# EAGLE design cruise (EAGLE 9.3.1)
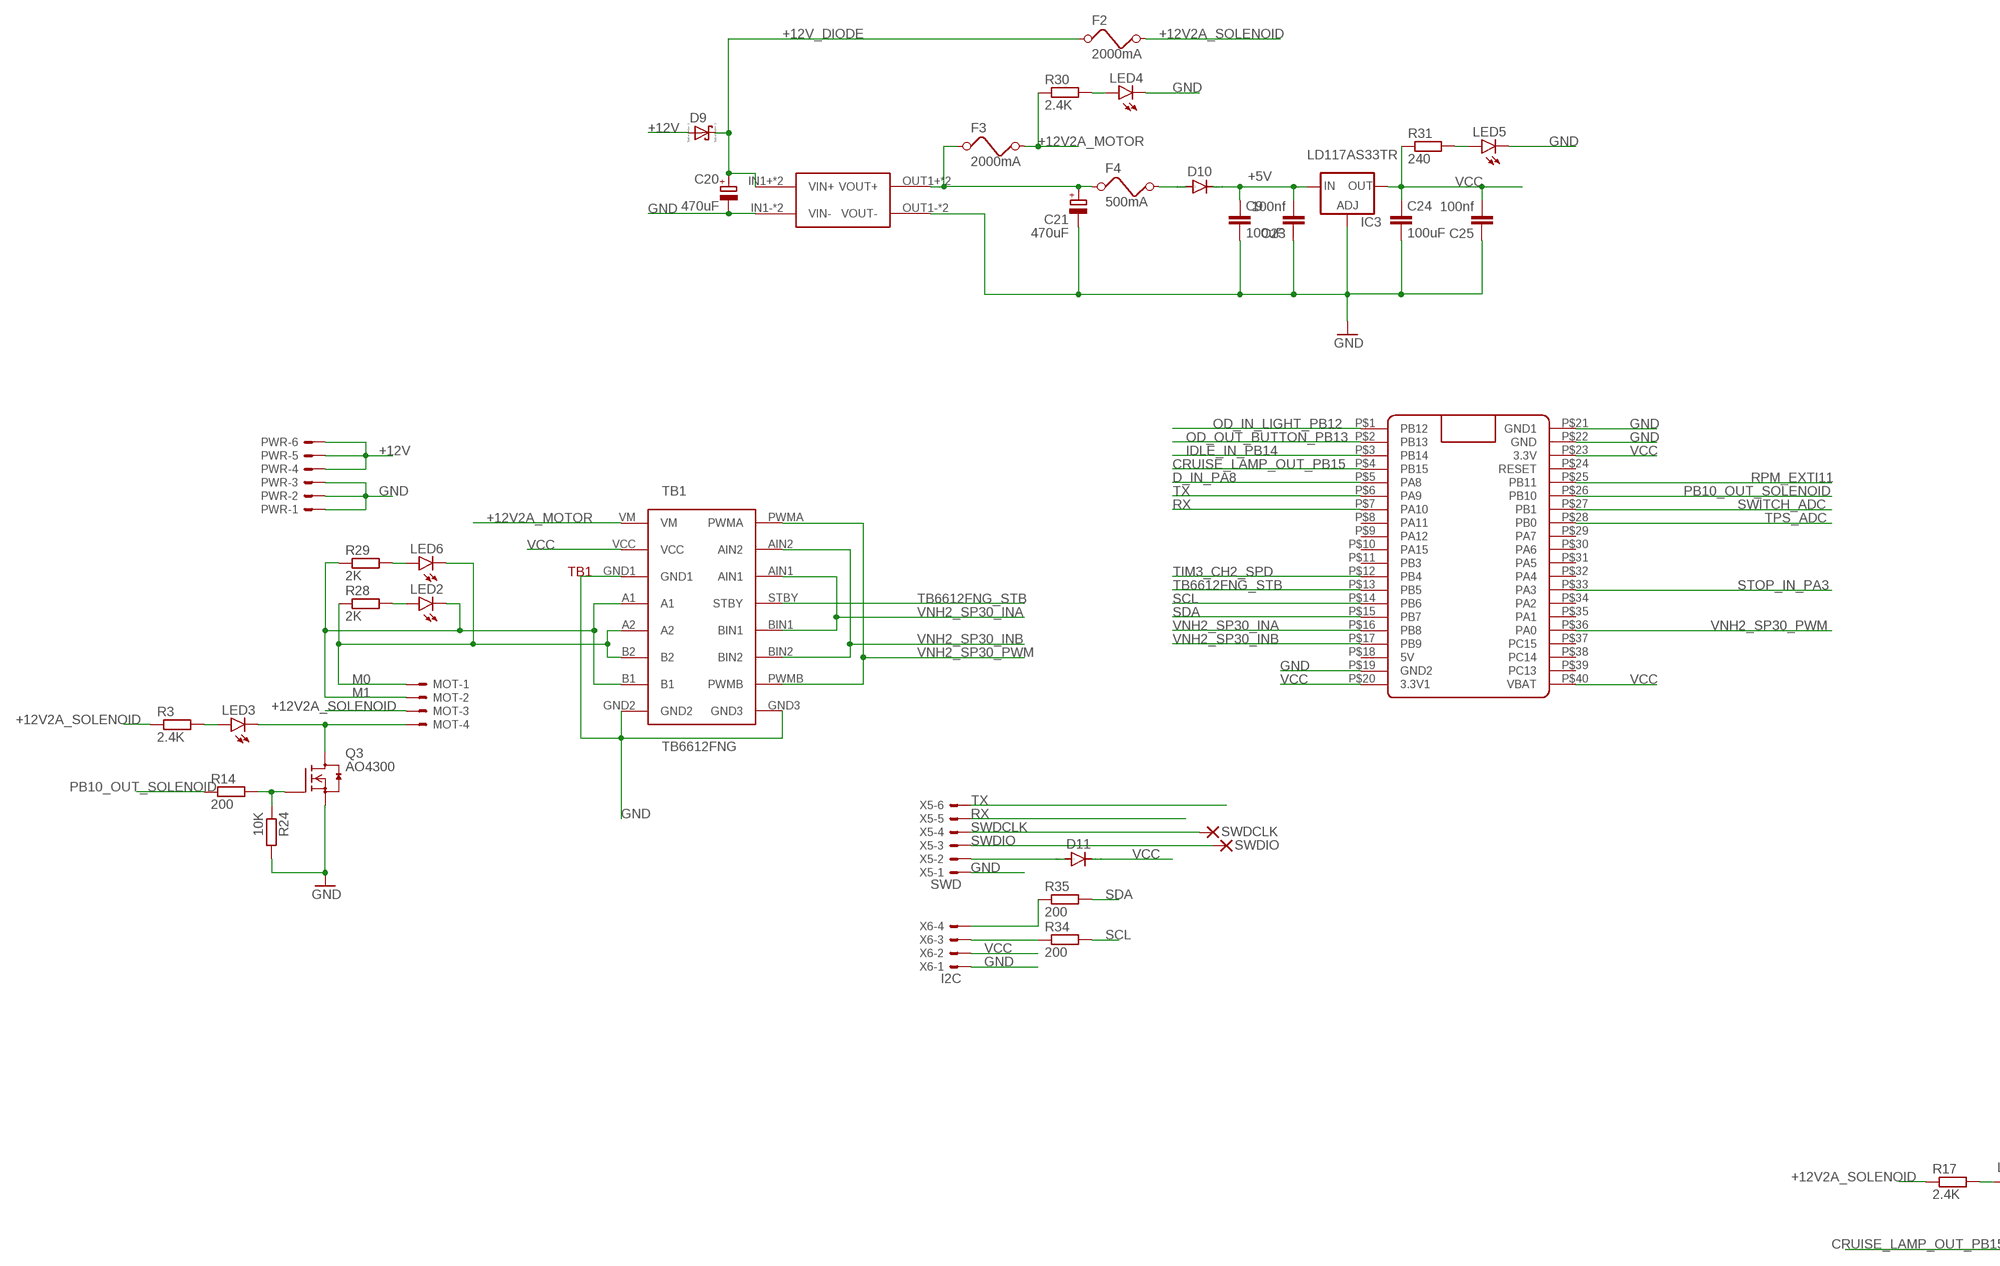
[diagram p0: schematic, sheet 1, part 1 of 2]
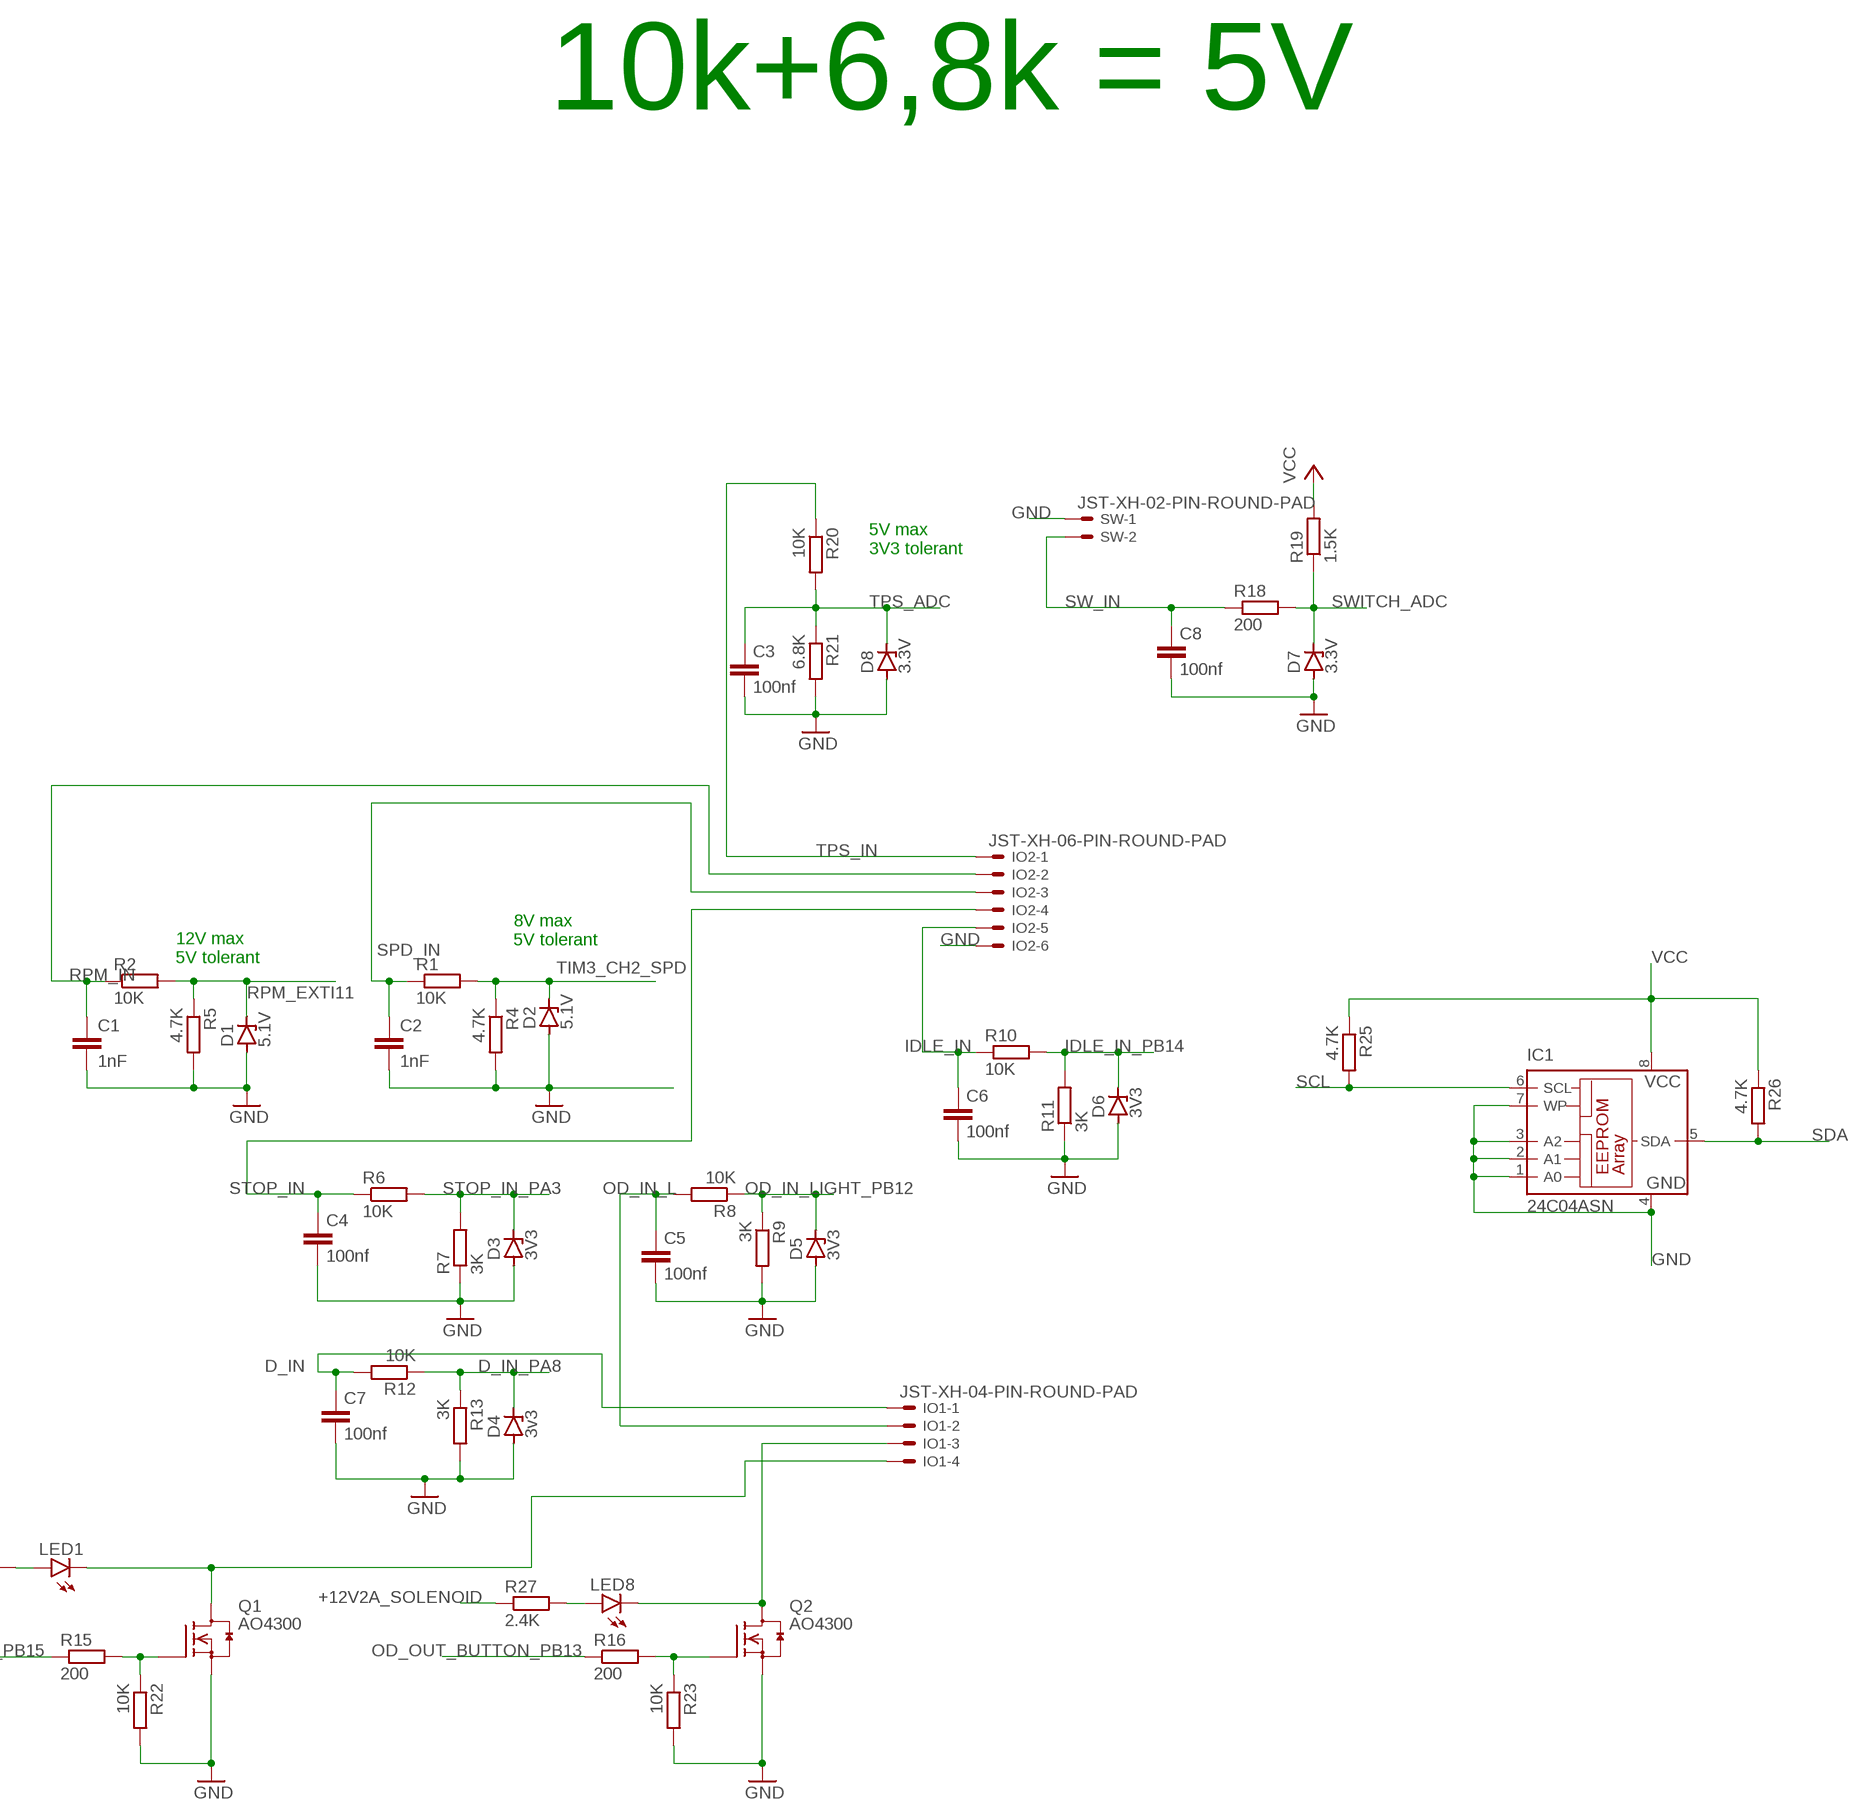
[diagram p1: schematic, sheet 1, part 2 of 2]

## Parts
C1  1nF  C-EUC0805K  [C0805K]
C2  1nF  C-EUC0805K  [C0805K]
C3  100nf  C-EUC0805K  [C0805K]
C4  100nf  C-EUC0805K  [C0805K]
C5  100nf  C-EUC0805K  [C0805K]
C6  100nf  C-EUC0805K  [C0805K]
C7  100nf  C-EUC0805K  [C0805K]
C8  100nf  C-EUC0805K  [C0805K]
C9  100uF  C-EUC1210  [C1210]
C20  470uF  CPOL-EUG  [PANASONIC_G]
C21  470uF  CPOL-EUG  [PANASONIC_G]
C23  100nf  C-EUC0805  [C0805]
C24  100uF  C-EUC1210  [C1210]
C25  100nf  C-EUC0805  [C0805]
D1  5.1V  ZENER-DIODESOD80C  [SOD80C]
D2  5.1V  ZENER-DIODESOD80C  [SOD80C]
D3  3V3  ZENER-DIODESOD80C  [SOD80C]
D4  3v3  ZENER-DIODESOD80C  [SOD80C]
D5  3V3  ZENER-DIODESOD80C  [SOD80C]
D6  3V3  ZENER-DIODESOD80C  [SOD80C]
D7  3.3V  ZENER-DIODESOD80C  [SOD80C]
D8  3.3V  ZENER-DIODESOD80C  [SOD80C]
D9  SCHOTTKY-DIODESMC  [DIODE_SMC]
D10  DIODE-SOD323-W  [SOD323-W]
D11  DIODE-SOD323-W  [SOD323-W]
F2  2000mA  FUSEC  [1206]
F3  2000mA  FUSEC  [1206]
F4  500mA  FUSEC  [1206]
IC1  24C04ASN  [SO-08]
IC3  LD117AS33TR  [SOT223]
IO1  JST-XH-04-PIN-ROUND-PAD  [JST-XH-04-PACKAGE-ROUND-PAD]
IO2  JST-XH-06-PIN-ROUND-PAD  [JST-XH-06-PACKAGE-ROUND-PAD]
LED1  LED3MM  [LED3MM]
LED2  LED3MM  [LED3MM]
LED3  LED3MM  [LED3MM]
LED4  LED3MM  [LED3MM]
LED5  LED3MM  [LED3MM]
LED6  LED3MM  [LED3MM]
LED8  LED3MM  [LED3MM]
MOT  JST-XH-04-PIN-LONG-PAD  [JST-XH-04-PACKAGE-LONG-PAD]
PWR  JST-XH-06-PIN-LONG-PAD  [JST-XH-06-PACKAGE-LONG-PAD]
Q1  AO4300  BSS138  [SOT23]
Q2  AO4300  BSS138  [SOT23]
Q3  AO4300  BSS138  [SOT23]
R1  10K  R-EU_R0805  [R0805]
R2  10K  R-EU_R0805  [R0805]
R3  2.4K  R-EU_R0805  [R0805]
R4  4.7K  R-EU_R0805  [R0805]
R5  4.7K  R-EU_R0805  [R0805]
R6  10K  R-EU_R0805  [R0805]
R7  3K  R-EU_R0805  [R0805]
R8  10K  R-EU_R0805  [R0805]
R9  3K  R-EU_R0805  [R0805]
R10  10K  R-EU_R0805  [R0805]
R11  3K  R-EU_R0805  [R0805]
R12  10K  R-EU_R0805  [R0805]
R13  3K  R-EU_R0805  [R0805]
R14  200  R-EU_R0805  [R0805]
R15  200  R-EU_R0805  [R0805]
R16  200  R-EU_R0805  [R0805]
R17  2.4K  R-EU_R0805  [R0805]
R18  200  R-EU_R0805  [R0805]
R19  1.5K  R-EU_R0805  [R0805]
R20  10K  R-EU_R0805  [R0805]
R21  6.8K  R-EU_R0805  [R0805]
R22  10K  R-EU_R0805  [R0805]
R23  10K  R-EU_R0805  [R0805]
R24  10K  R-EU_R0805  [R0805]
R25  4.7K  R-EU_R0805  [R0805]
R26  4.7K  R-EU_R0805  [R0805]
R27  2.4K  R-EU_R0805  [R0805]
R28  2K  R-EU_R0805  [R0805]
R29  2K  R-EU_R0805  [R0805]
R30  2.4K  R-EU_R0805  [R0805]
R31  240  R-EU_R0805  [R0805]
R34  200  R-EU_R0805  [R0805]
R35  200  R-EU_R0805  [R0805]
SW  JST-XH-02-PIN-ROUND-PAD  [JST-XH-02-PACKAGE-ROUND-PAD]
SWDCLK  WIREPAD2,15/1,0  [2,15/1,0]
SWDIO  WIREPAD2,15/1,0  [2,15/1,0]
TB1  TB6612FNG  [TB6612FNG]
U$1  BLUE_PILL  [BLUE_PILL]
U$6  MP1584  [DC-BRICK]
X5  SWD  JST-XH-06-PIN-ROUND-PAD  [JST-XH-06-PACKAGE-ROUND-PAD]
X6  I2C  JST-XH-04-PIN-ROUND-PAD  [JST-XH-04-PACKAGE-ROUND-PAD]

## Nets
+5V: C9.1 C23.2 D10.C IC3.3(IN)
+12V: D9.A(C) PWR.4 PWR.5 PWR.6
+12V2A_MOTOR: F3.2 R30.1 TB1.VM
+12V2A_SOLENOID: F2.2 MOT.3 R3.1 R17.1 R27.1
+12V_DIODE: C20.+ D9.C(A) F2.1 U$6.IN1+(VIN+) U$6.IN2+(VIN+)
CRUISE_LAMP_OUT_PB15: R15.1 U$1.P$4(PB15)
D_IN: C7.1 IO1.1 R12.2
D_IN_PA8: D4.C R12.1 R13.1 U$1.P$5(PA8)
GND: C1.2 C2.2 C3.2 C4.2 C5.2 C6.2 C7.2 C8.2 C9.2 C20.- C21.- C23.1 C24.2 C25.1 D1.A D2.A D3.A D4.A D5.A D6.A D7.A D8.A IC1.1(A0) IC1.2(A1) IC1.3(A2) IC1.4(GND) IC1.7(WP) IC3.1(ADJ) IO2.6 LED4.K(C) LED5.K(C) PWR.1 PWR.2 PWR.3 Q1.2(S) Q2.2(S) Q3.2(S) R4.2 R5.2 R7.1 R9.2 R11.1 R13.2 R21.2 R22.2 R23.2 R24.2 SW.1 TB1.GND1 TB1.GND2 TB1.GND3 U$1.P$19(GND2) U$1.P$21(GND1) U$1.P$22(GND) U$6.IN1-(VIN-) U$6.IN2-(VIN-) U$6.OUT1-(VOUT-) U$6.OUT2-(VOUT-) X5.1 X6.1
IDLE_IN: C6.1 IO2.5 R10.1
IDLE_IN_PB14: D6.C R10.2 R11.2 U$1.P$3(PB14)
M0: LED6.K(C) MOT.1 R28.1 TB1.A2 TB1.B2
M1: LED2.K(C) MOT.2 R29.1 TB1.A1 TB1.B1
N$1: LED1.A R17.2
N$2: D10.A F4.2
N$3: D11.A X5.2
N$4: LED3.A R3.2
N$5: C21.+ F3.1 F4.1 U$6.OUT1+(VOUT+) U$6.OUT2+(VOUT+)
N$6: LED3.K(C) MOT.4 Q3.3(D)
N$7: LED2.A R28.2
N$8: Q3.1(G) R14.2 R24.1
N$9: LED8.A R27.2
N$10: Q1.1(G) R15.2 R22.1
N$11: R34.1 X6.3
N$12: R35.1 X6.4
N$13: LED6.A R29.2
N$14: Q2.1(G) R16.2 R23.1
N$15: LED4.A R30.2
N$16: LED5.A R31.2
N$32: IO1.4 LED1.K(C) Q1.3(D)
N$35: IO1.3 LED8.K(C) Q2.3(D)
OD_IN_L: C5.1 IO1.2 R8.2
OD_IN_LIGHT_PB12: D5.C R8.1 R9.1 U$1.P$1(PB12)
OD_OUT_BUTTON_PB13: R16.1 U$1.P$2(PB13)
PB10_OUT_SOLENOID: R14.1 U$1.P$26(PB10)
RPM_EXTI11: D1.C R2.2 R5.1 U$1.P$25(PB11)
RPM_IN: C1.1 IO2.2 R2.1
RX: U$1.P$7(PA10) X5.5
SCL: IC1.6(SCL) R25.2 R34.2 U$1.P$14(PB6)
SDA: IC1.5(SDA) R26.2 R35.2 U$1.P$15(PB7)
SPD_IN: C2.1 IO2.3 R1.1
STOP_IN: C4.1 IO2.4 R6.1
STOP_IN_PA3: D3.C R6.2 R7.2 U$1.P$33(PA3)
SW_IN: C8.1 R18.1 SW.2
SWDCLK: SWDCLK.1(P) X5.4
SWDIO: SWDIO.1(P) X5.3
SWITCH_ADC: D7.C R18.2 R19.1 U$1.P$27(PB1)
TB6612FNG_STB: TB1.STBY U$1.P$13(PB5)
TIM3_CH2_SPD: D2.C R1.2 R4.1 U$1.P$12(PB4)
TPS_ADC: C3.1 D8.C R20.2 R21.1 U$1.P$28(PB0)
TPS_IN: IO2.1 R20.1
TX: U$1.P$6(PA9) X5.6
VCC: C24.1 C25.2 D11.C IC1.8(VCC) IC3.4(OUT) R19.2 R25.1 R26.1 R31.1 TB1.VCC U$1.P$20(3.3V1) U$1.P$23(3.3V) U$1.P$40(VBAT) X6.2
VNH2_SP30_INA: TB1.AIN1 TB1.BIN1 U$1.P$16(PB8)
VNH2_SP30_INB: TB1.AIN2 TB1.BIN2 U$1.P$17(PB9)
VNH2_SP30_PWM: TB1.PWMA TB1.PWMB U$1.P$36(PA0)
Unconnected: U$1.P$8(PA11) U$1.P$9(PA12) U$1.P$10(PA15) U$1.P$11(PB3) U$1.P$18(5V) U$1.P$24(RESET) U$1.P$29(PA7) U$1.P$30(PA6) U$1.P$31(PA5) U$1.P$32(PA4) U$1.P$34(PA2) U$1.P$35(PA1) U$1.P$37(PC15) U$1.P$38(PC14) U$1.P$39(PC13)

## Notes on the sheet
- 10k+6,8k = 5V
- 5V max
  3V3 tolerant
- 8V max
  5V tolerant
- 12V max
  5V tolerant

## Library data of the parts
C1-C8 C23 C25 = rcl:C-EU: CAPACITOR, European symbol; SPICEPREFIX: C
C9 C24 = resistor:C-EU: CAPACITOR, European symbol
C20 C21 = rcl:CPOL-EU: POLARIZED CAPACITOR, European symbol; SPICEPREFIX: C
D1-D8 = diode:ZENER-DIODE: Z-Diode
D9 = eagle-ltspice:SCHOTTKY-DIODE: Schottky Diode; SPICEMODEL: NONE; SPICEPREFIX: D; SPICETYPE: diode
D10 D11 = diode:DIODE-: DIODE
F2-F4 = m-pad-2.1:FUSE: Fuse's in various packages
IC1 = microchip:24C*: Serial EEPROM 1 K/2 K/4 K; OC_FARNELL: unknown; OC_NEWARK: unknown
IC3 = v-reg:LD117A?*: Low drop fixed and adjustable positive voltage regulators 1 A Source: http://www.st.com/stonline/products/literature/ds/7194/ld1117axx.pdf
IO1 MOT X6 = Rembrandt Electronics - JST XH Connectors v1-0:JST-XH-04-PIN: JST XH Connector 2 Pin Wire to board connector. Pitch: 2,54 mm, (0.100") Number of pins: 4 Created by Rembrandt Electronics www.rembrandtelectronics.com
IO2 PWR X5 = Rembrandt Electronics - JST XH Connectors v1-0:JST-XH-06-PIN: JST XH Connector 2 Pin Wire to board connector. Pitch: 2,54 mm, (0.100") Number of pins: 6 Created by Rembrandt Electronics www.rembrandtelectronics.com
LED1-LED6 LED8 = led:LED: LED OSRAM: - CHIPLED LG R971, LG N971, LY N971, LG Q971, LY Q971, LO R971, LY R971 LH N974, LH R974 LS Q976, LO Q976, LY Q976 LO Q996 - Hyper CHIPLED LW Q18S LB Q993, LB Q99A, LB R99A - SideLED LS A670, LO A670, LY A670, LG A670, LP A670 LB A673, LV A673, LT A673, LW A673 LH A674 LY A675 LS A676, LA A676, LO A676, LY A676, LW A676 LS A679, LY A679, LG A679 - Hyper Micro SIDELED® LS Y876, LA Y876, LO Y876, LY Y876 LT Y87S - SmartLED LW L88C, LW L88S LB L89C, LB L89S, LG L890 LS L89K, LO L89K, LY L89K LS L896, LA L896, LO L896, LY L896 - TOPLED LS T670, LO T670, LY T670, LG T670, LP T670 LSG T670, LSP T670, LSY T670, LOP T670, LYG T670 LG T671, LOG T671, LSG T671 LB T673, LV T673, LT T673, LW T673 LH T674 LS T676, LA T676, LO T676, LY T676, LB T676, LH T676, LSB T676, LW T676 LB T67C, LV T67C, LT T67C, LS T67K, LO T67K, LY T67K, LW E67C LS E67B, LA E67B, LO E67B, LY E67B, LB E67C, LV E67C, LT E67C LW T67C LS T679, LY T679, LG T679 LS T770, LO T770, LY T770, LG T770, LP T770 LB T773, LV T773, LT T773, LW T773 LH T774 LS E675, LA E675, LY E675, LS T675 LS T776, LA T776, LO T776, LY T776, LB T776 LHGB T686 LT T68C, LB T68C - Hyper Mini TOPLED® LB M676 - Mini TOPLED Santana® LG M470 LS M47K, LO M47K, LY M47K Source: http://www.osram.convergy.de LUXEON: - LUMILED® LXK2-PW12-R00, LXK2-PW12-S00, LXK2-PW14-U00, LXK2-PW14-V00 LXK2-PM12-R00, LXK2-PM12-S00, LXK2-PM14-U00 LXK2-PE12-Q00, LXK2-PE12-R00, LXK2-PE12-S00, LXK2-PE14-T00, LXK2-PE14-U00 LXK2-PB12-K00, LXK2-PB12-L00, LXK2-PB12-M00, LXK2-PB14-N00, LXK2-PB14-P00, LXK2-PB14-Q00 LXK2-PR12-L00, LXK2-PR12-M00, LXK2-PR14-Q00, LXK2-PR14-R00 LXK2-PD12-Q00, LXK2-PD12-R00, LXK2-PD12-S00 LXK2-PH12-R00, LXK2-PH12-S00 LXK2-PL12-P00, LXK2-PL12-Q00, LXK2-PL12-R00 Source: www.luxeon.com KINGBRIGHT: KA-3528ASYC Source: www.kingbright.com
Q1-Q3 = m-pad-2.1:BSS138: Fairchild Semiconductors BSS138 N-Channel Logic Level Enhancement Mode Field Effect Transistor General Description: These N-Channel enhancement mode field effect transistors are produced using Fairchild's proprietary, high cell density, DMOS technology. These products have been designed to minimize on-state resistance while provide rugged, reliable, and fast switching performance.These products are particularly suited for low voltage, low current applications such as small servo motor control, power MOSFET gate drivers, and other switching applications. Features: 0.22 A, 50 V. RDS(ON) = 3.5Ohm @ VGS = 10 V RDS(ON) = 6.0Ohm @ VGS = 4.5 V High density cell design for extremely low RDS(ON) Rugged and Reliable Compact industry standard SOT-23 surface mount package Please send any comments to: messi@users.sourceforge.net
R1-R31 R34 R35 = resistor:R-EU_: RESISTOR, European symbol
SW = Rembrandt Electronics - JST XH Connectors v1-0:JST-XH-02-PIN: JST XH Connector 2 Pin Wire to board connector. Pitch: 2,54 mm, (0.100") Number of pins: 2 Created by Rembrandt Electronics www.rembrandtelectronics.com
SWDCLK SWDIO = wirepad:WIREPAD: Wire PAD connect wire on PCB
TB1 = TB6612FNG:TB6612FNG
U$1 = BluePill:BLUE_PILL
U$6 = MP1584-dc-brick:MP1584: MP1584-dc-brick-pcb Step down Input: 4.5V - 28V Ouput 0.8V - 25V max. 3A Cheap on ebay

## Board
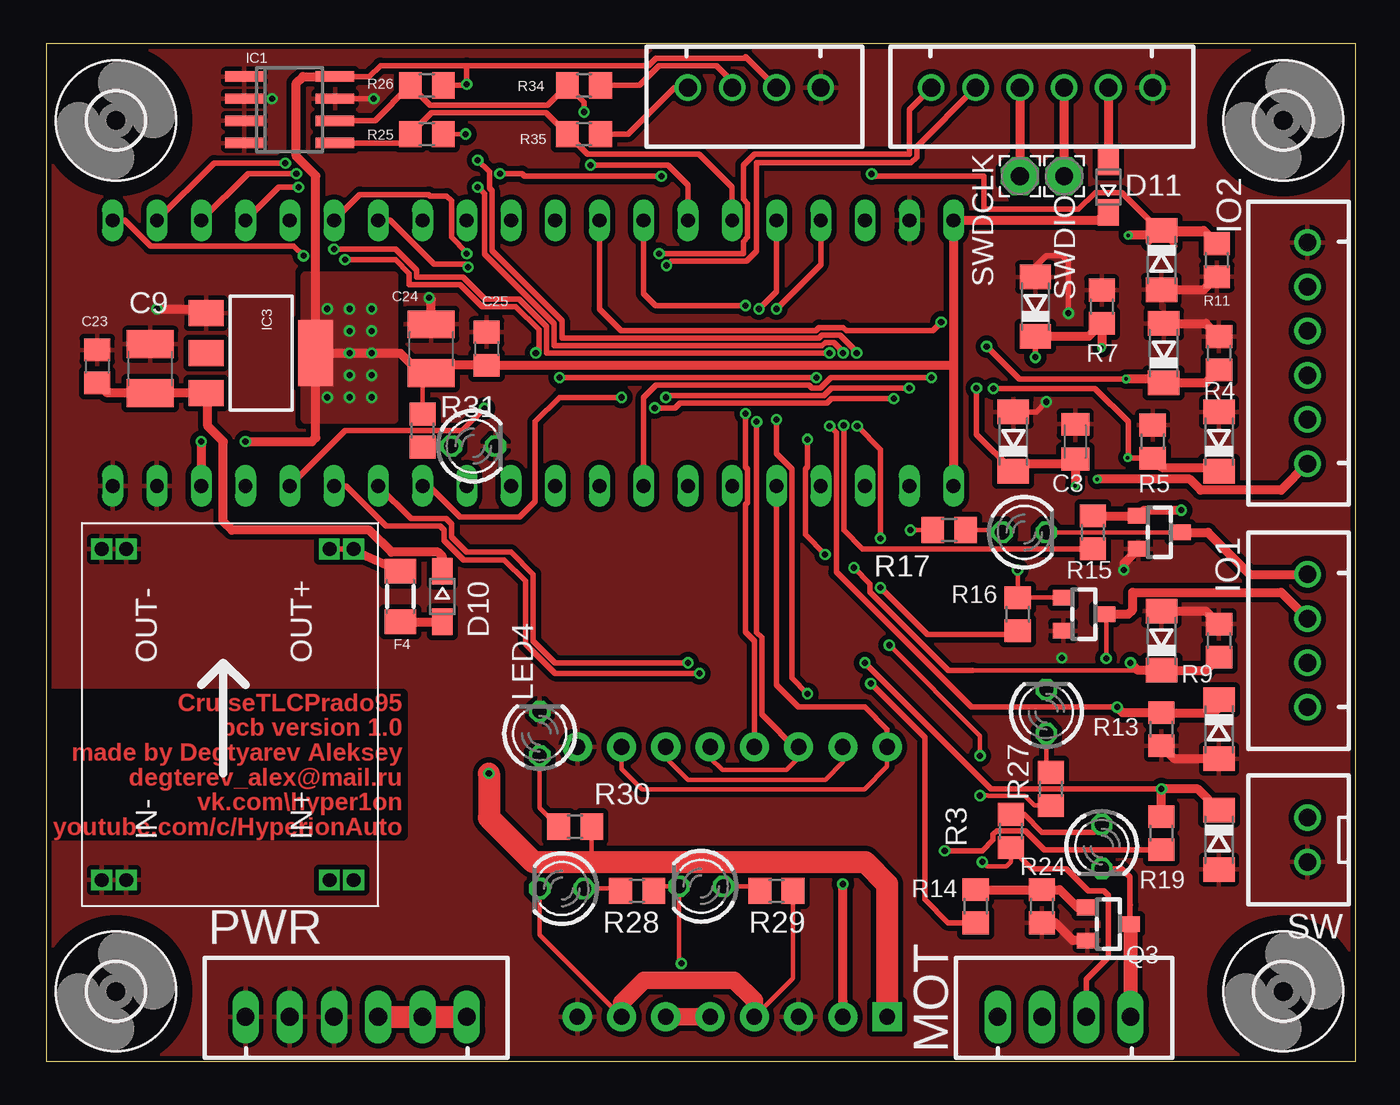
[diagram p2: board, top side]
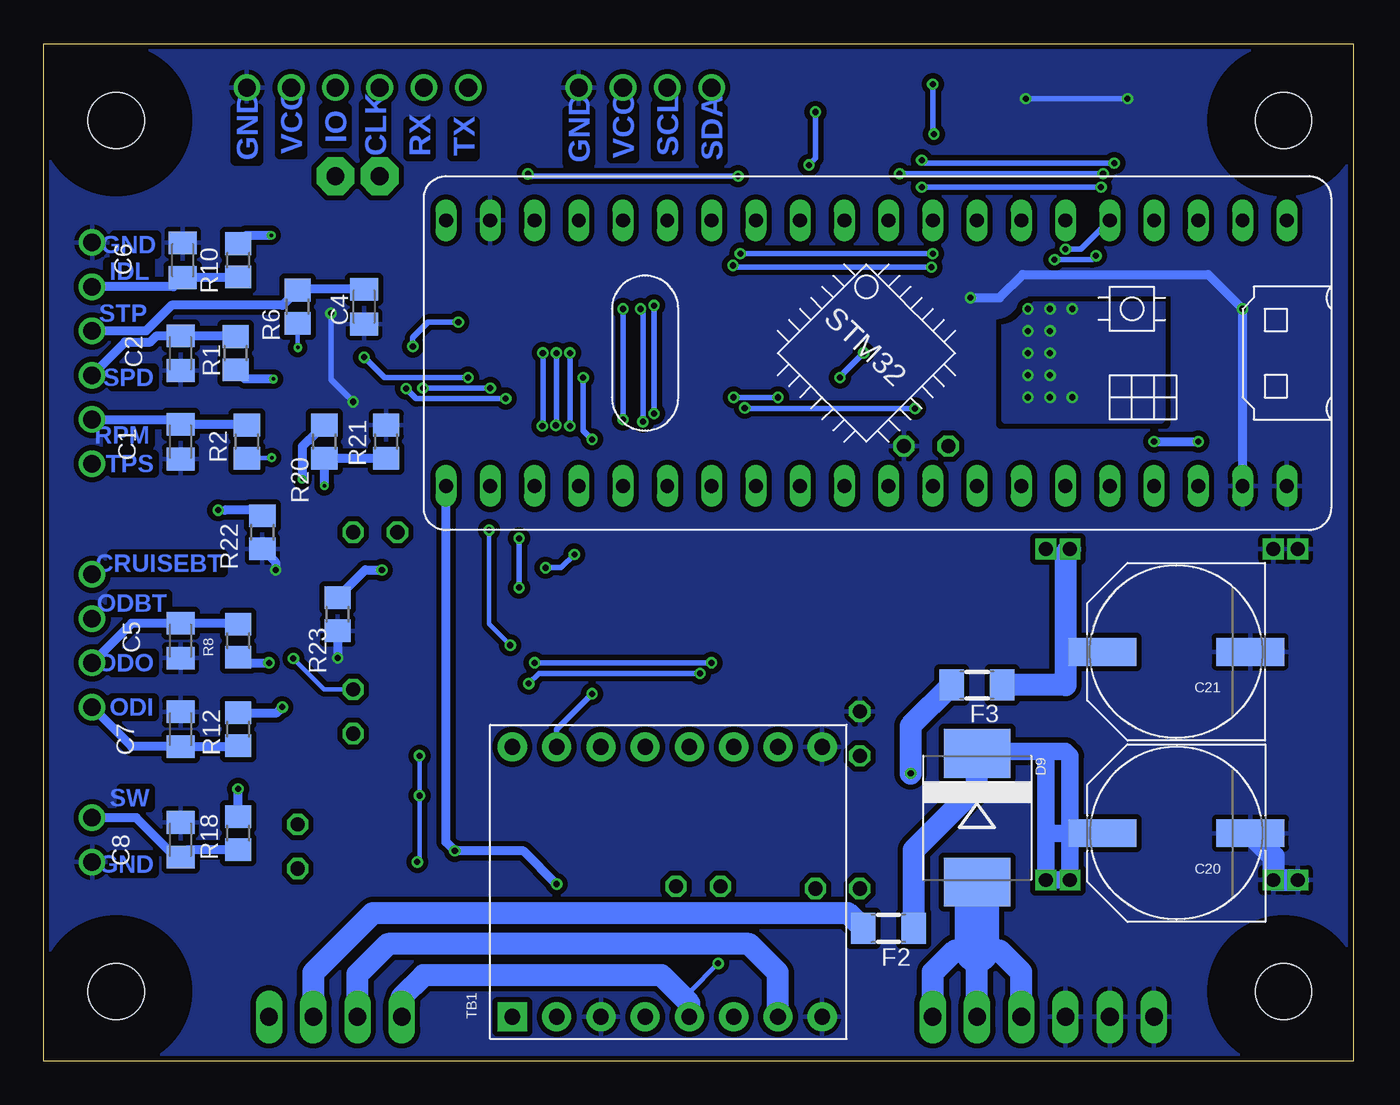
[diagram p3: board, bottom side, seen from below]

Size 75.17 x 58.41 mm. Coordinates in mm from the lower left corner, seen from the top.
Outline: 0,0 75.17,0 75.17,58.41 0,58.41 0,0
Copper layers (1*16): Top 0.035mm / dielectric 1.5mm / Bottom 0.035mm
Design rules "jlcpcb": minimum track width 5mil, minimum drill 0.2mm, track to track 5mil, track to pad 5mil, pad to pad 5mil, via to via 5mil, smd to smd 5mil, copper to edge 0.2mm, drill to drill 6mil, minimum pad ring 0.2mm, minimum via ring 0.15mm, stop-mask expansion 4mil, vias tented up to drill 0mil, thermal gap 10mil

### Footprints (pad centres in the part's own frame; a part is rotated, then mirrored left to right if it is on the bottom)
C0805K = smd 1.3 x 1.6: 1 -1,0; 2 1,0
C1210 = smd 1.6 x 2.7: 1 -1.4,0; 2 1.4,0
PANASONIC_G = smd 3.9 x 1.6: + 4.25,0; - -4.25,0
C0805 = smd 1.3 x 1.5: 1 -0.95,0; 2 0.95,0
SOD80C = smd 1.4 x 1.8: A 1.7,0; C -1.7,0
DIODE_SMC = smd 2.8 x 3.8: A 3.7,0; C -3.7,0
SOD323-W = smd 1.5 x 1.2: A 1.45,0; C -1.45,0
1206 = smd 1.4 x 1.8: 1 -1.45,0; 2 1.45,0
SO-08 = smd 0.6 x 2.2: 1 -1.905,-2.6; 2 -0.635,-2.6; 3 0.635,-2.6; 4 1.905,-2.6; 5 1.905,2.6; 6 0.635,2.6; 7 -0.635,2.6; 8 -1.905,2.6
SOT223 = smd 1.5 x 2: 1 -2.3,-3.15; 2 0,-3.15; 3 2.3,-3.15 | smd 3.8 x 2: 4 0,3.15
JST-XH-04-PACKAGE-ROUND-PAD = drill 1.016: 1 -3.81,0; 2 -1.27,0; 3 1.27,0; 4 3.81,0
JST-XH-06-PACKAGE-ROUND-PAD = drill 1.016: 1 -6.35,0; 2 -3.81,0; 3 -1.27,0; 4 1.27,0; 5 3.81,0; 6 6.35,0
LED3MM = drill 0.813 octagon: A -1.27,0; K 1.27,0
JST-XH-04-PACKAGE-LONG-PAD = drill 1.016 long: 1 -3.81,0; 2 -1.27,0; 3 1.27,0; 4 3.81,0
JST-XH-06-PACKAGE-LONG-PAD = drill 1.016 long: 1 -6.35,0; 2 -3.81,0; 3 -1.27,0; 4 1.27,0; 5 3.81,0; 6 6.35,0
SOT23 = smd 0.9 x 1.2: 1 -0.95,-1.2; 2 0.95,-1.2; 3 0,1.2
R0805 = smd 1.3 x 1.5: 1 -0.95,0; 2 0.95,0
JST-XH-02-PACKAGE-ROUND-PAD = drill 1.016: 1 -1.27,0; 2 1.27,0
2,15/1,0 = drill 1.016 pad 2.159 octagon: 1 0,0
TB6612FNG = drill 0.9 pad 1.676: A1 -7.62,-1.27; A2 -7.62,-3.81; AIN1 7.874,1.27; AIN2 7.874,3.81; B1 -7.62,-8.89; B2 -7.62,-6.35; BIN1 7.874,-3.81; BIN2 7.874,-6.35; GND1 -7.62,1.27; GND2 -7.62,-11.43; GND3 7.874,-11.43; PWMA 7.874,6.35; PWMB 7.874,-8.89; STBY 7.874,-1.27; VCC -7.62,3.81 | drill 0.9 pad 1.676 square: VM -7.62,6.35
BLUE_PILL = drill 0.8 long: P$1 -7.62,15.24; P$2 -7.62,12.7; P$3 -7.62,10.16; P$4 -7.62,7.62; P$5 -7.62,5.08; P$6 -7.62,2.54; P$7 -7.62,0; P$8 -7.62,-2.54; P$9 -7.62,-5.08; P$10 -7.62,-7.62; P$11 -7.62,-10.16; P$12 -7.62,-12.7; P$13 -7.62,-15.24; P$14 -7.62,-17.78; P$15 -7.62,-20.32; P$16 -7.62,-22.86; P$17 -7.62,-25.4; P$18 -7.62,-27.94; P$19 -7.62,-30.48; P$20 -7.62,-33.02; P$21 7.62,15.24; P$22 7.62,12.7; P$23 7.62,10.16; P$24 7.62,7.62; P$25 7.62,5.08; P$26 7.62,2.54; P$27 7.62,0; P$28 7.62,-2.54; P$29 7.62,-5.08; P$30 7.62,-7.62; P$31 7.62,-10.16; P$32 7.62,-12.7; P$33 7.62,-15.24; P$34 7.62,-17.78; P$35 7.62,-20.32; P$36 7.62,-22.86; P$37 7.62,-25.4; P$38 7.62,-27.94; P$39 7.62,-30.48; P$40 7.62,-33.02
3,2 = hole 3.2: 0,0
DC-BRICK = drill 0.8 square: IN1+ 1.5,1.4; IN1- 1.5,14.47; IN2+ 1.5,2.8; IN2- 1.5,15.87; OUT1+ 20.5,1.4; OUT1- 20.5,14.47; OUT2+ 20.5,2.8; OUT2- 20.5,15.87

### Placement (x,y rotation side)
C1  67.31,35.56 270 bottom
C2  67.31,40.64 270 bottom
C3  59.05,35.56 90 top
C4  56.77,43.31 270 bottom
C5  67.31,24.13 270 bottom
C6  67.18,45.97 90 bottom
C7  67.31,19.05 90 bottom
C8  67.31,12.7 90 bottom
C9  5.97,39.75 90 top
C20  10.15,13.08 180 bottom
C21  10.16,23.5 180 bottom
C23  2.92,39.88 270 top
C24  22.1,40.89 90 top
C25  25.27,40.89 270 top
D1  67.31,35.56 90 top
D2  64.14,40.64 90 top
D3  56.77,43.31 90 top
D4  67.31,19.05 270 top
D5  64.01,24.13 90 top
D6  64.01,45.97 270 top
D7  67.31,12.7 270 top
D8  55.5,35.56 90 top
D9  21.59,13.97 270 bottom
D10  22.73,26.67 270 top
D11  60.96,50.16 90 top
F2  26.67,7.62 180 bottom
F3  21.59,21.59 180 bottom
F4  20.32,26.67 270 top
IC1  13.97,54.61 270 top
IC3  12.32,40.64 270 top
IO1  72.39,24.13 90 top
IO2  72.39,40.64 90 top
LED1  56.13,30.35 0 top
LED2  29.59,9.91 180 top
LED3  60.58,12.32 270 top
LED4  28.32,18.8 90 top
LED5  24.51,35.31 0 top
LED6  37.59,10.03 180 top
LED8  57.4,20.07 90 top
MOT  58.42,2.54 0 top
PWR  17.78,2.54 0 top
Q1  63.88,30.35 270 top
Q2  59.56,25.65 270 top
Q3  60.96,7.87 270 top
R1  64.14,40.64 270 bottom
R2  63.5,35.56 270 bottom
R3  55.37,13.21 90 top
R4  67.31,40.64 90 top
R5  63.5,35.56 90 top
R6  60.58,43.31 270 bottom
R7  60.58,43.31 270 top
R8  64.01,24.13 90 bottom
R9  67.31,24.13 90 top
R10  64.01,45.97 90 bottom
R11  67.18,45.97 90 top
R12  64.01,19.05 270 bottom
R13  64.01,19.05 270 top
R14  53.34,8.89 90 top
R15  60.07,30.35 90 top
R16  55.75,25.65 90 top
R17  51.82,30.48 0 top
R18  64.01,13.08 90 bottom
R19  64.01,13.08 270 top
R20  59.05,35.56 270 bottom
R21  55.5,35.56 90 bottom
R22  62.61,30.35 270 bottom
R23  58.29,25.65 270 bottom
R24  57.15,8.89 270 top
R25  21.84,56.01 180 top
R26  21.84,53.21 180 top
R27  57.66,15.62 90 top
R28  33.91,9.78 180 top
R29  41.91,9.78 180 top
R30  30.35,13.46 180 top
R31  21.59,36.2 270 top
R34  30.86,56.01 180 top
R35  30.86,53.21 180 top
SW  72.39,12.7 90 top
SWDCLK  55.88,50.8 0 top
SWDIO  58.42,50.8 0 top
TB1  41.91,10.16 90 bottom
U$1  19.05,40.64 270 bottom
U$2  [3,2]  4,54 0 top
U$3  [3,2]  71,54 0 top
U$4  [3,2]  71,4 0 top
U$5  [3,2]  4,4 0 top
U$6  19.05,8.89 90 top
X5  57.15,55.88 180 top
X6  40.64,55.88 180 top

### Tracks (layer width: path | path; a pad name or v marks a point on that pad's centre or on a via)
+5V
  Top 0.508: 9.27,38.24 9.27,36.45 10.16,35.56 10.16,30.99 10.67,30.48 18.54,30.48 19.81,29.21 22.48,29.21 22.73,28.96 D10.C | IC3.3 C9.1 3.5,38.35 C23.2
  Top 1.27: 9.27,38.24 IC3.3
+12V
  Top 1.27: PWR.4 PWR.5 PWR.6
  Bottom 1.27: PWR.4 19.05,5.1 20.3,6.35 21.59,6.35 | PWR.6 24.13,5.1 24.11,5.1 22.86,6.35 21.59,6.35 | PWR.5 21.59,6.35
  Bottom 2.54: 21.59,6.35 D9.A
+12V2A_MOTOR  (via drill 0.35)
  Top 0.254: 31.75,11.43 31.3,11.88 R30.1
  Top 1.27: v25.4,16.51 25.4,13.97 27.94,11.43 31.75,11.43 46.99,11.43 48.26,10.16 TB1.VM
  Bottom 1.27: F3.2 25.4,19.23 v25.4,16.51
+12V2A_SOLENOID  (via drill 0.35)
  Top 0.254: v48.39,23.88 53.59,18.67 v53.59,17.53 | v53.72,11.43 53.98,11.18 55.12,11.18 55.37,11.43 R3.1 | v53.59,15.24 54.03,15.24 54.06,15.21 56.16,15.21 56.7,14.67 R27.1 | v49.6,30.48 R17.1
  Top 0.305: R3.1 56.58,11.05 58.55,11.05 59.82,9.78 60.71,9.78 60.96,9.53 60.96,5.97 59.69,4.7 MOT.3
  Bottom 0.254: v49.6,30.48 49.6,25.09 v48.39,23.88 | v53.59,17.53 v53.59,15.24 53.59,11.56 v53.72,11.43
  Bottom 1.27: MOT.3 59.69,5.08 56.26,8.51 29.01,8.51 F2.2
+12V_DIODE
  Bottom 1.016: 17.65,13.08 U$6.IN1+ U$6.IN2+ 16.25,17.52 16.51,17.78 17.78,17.78 | 17.65,13.08 17.65,17.65 17.78,17.78 | 17.78,17.78 21.59,17.78 D9.C | 17.65,13.08 15.67,13.08 15.66,13.08 C20.+
  Bottom 1.27: 21.59,17.78 21.59,15.75 25.22,12.12 F2.1
CRUISE_LAMP_OUT_PB15  (via drill 0.35)
  Top 0.152: 59.87,29.61 R15.1 59.69,29.4 57.47,29.4
  Top 0.305: U$1.P$4 13.34,50.16 v14.48,50.16 | v24.77,50.16 25.15,49.78 25.15,46.33 29.13,42.34 29.13,41.07 44.52,41.07 44.71,41.25 45.21,41.25 45.56,40.9 45.56,40.82 v45.73,40.65 | v45.77,36.49 45.72,36.45 45.72,36.3 45.77,36.25 45.77,30.48 46.85,29.4 59.69,29.4
  Bottom 0.305: v14.48,50.16 v24.77,50.16 | v45.73,40.65 45.73,36.53 v45.77,36.49
D_IN
  Bottom 0.2: 67.58,17.78 C7.1
  Bottom 0.508: IO1.1 70.12,18.05 C7.1 64.06,18.05 R12.2
D_IN_PA8  (via drill 0.35)
  Top 0.152: 67.53,20.54 D4.C
  Top 0.305: v44.96,40.65 44.95,40.64 28.7,40.64 28.7,42.16 27.13,43.74 25.2,43.74 23.93,45.01 21.26,45.01 21.26,45.39 20.04,46.61 v16.51,46.61 | v44.96,36.45 45.34,36.07 45.34,28.07 53.09,20.32 v61.47,20.32
  Top 0.508: 67.53,20.54 66.99,20 R12.1 61.79,20 v61.47,20.32
  Bottom 0.305: U$1.P$5 15.62,46.61 v16.51,46.61 | v44.96,40.65 v44.96,36.45
  Bottom 0.508: R12.1 61.79,20 v61.47,20.32
GND  (via drill 0.35)
  Top 0.152: D5.A 63.58,25.83
  Top 0.254: 67.15,25.24 R9.2
  Top 0.305: IC1.2 v12.95,55.24 | v18.8,55.24 IC1.7 | D8.A 56.82,37.26 v57.4,37.85 | v58.67,42.93 58.67,45.85 58.29,46.23 57.4,46.23 56.77,45.59 D3.A
  Top 0.508: D4.A 64.76,17.35 R13.2 | D5.A 66.56,25.83 67.15,25.24 | Q1.2 61.85,28.57 v61.85,28.19 | D2.A 66.56,42.34 R4.2 | D6.A 66.43,44.27 R11.1 | Q3.2 58.93,6.92 57.91,7.94 R24.2 | v6.35,43.18 8.93,43.18 IC3.1 | C24.2 22.1,43.69 v21.97,43.81
  Bottom 0.152: R22.2 62.29,29.08
  Bottom 0.305: v12.95,55.24 v18.8,55.24 | v57.4,37.85 58.67,39.12 v58.67,42.93
  Bottom 0.508: R22.2 61.85,28.64 v61.85,28.19 | R23.2 v58.29,23.14 | U$1.P$22 v6.35,43.18 8.33,45.16 18.96,45.16 20.3,43.81 v21.97,43.81
  Bottom 1.27: C20.- 4.58,11.76 U$6.IN1- U$6.IN2-
  pour Top (isolate 0.3, rank 2): 0.25,58.42 0.25,2.54 2.79,0 74.93,0 74.93,58.42
  pour Bottom (isolate 0.3, rank 6): 0,58.42 74.93,58.42 74.93,0 0,0
IDLE_IN
  Bottom 0.508: R10.1 64.06,44.97 C6.1 67.71,44.45 IO2.5
IDLE_IN_PB14  (via drill 0.2, 0.35)
  Top 0.152: 64.01,47.56 D6.C 63.79,47.46
  Top 0.2: R11.2 66.65,47.46 | 64.17,47.4 64.01,47.56
  Top 0.254: 63.26,46.92 63.79,47.46 66.65,47.46 | 64.8,46.77 64.17,47.4 v62.1,47.4
  Top 0.305: 64.17,47.4 61.73,49.85 60.2,49.85 59.25,48.9 53.81,48.9 53.81,50.8 47.5,50.8 v47.37,50.93 | U$1.P$3 11.57,50.94 v14.35,50.94 | v26.04,50.94 27.3,50.94 27.45,50.8 v35.31,50.8
  Top 0.508: R11.2 66.43,47.67 D6.C 63.74,47.4 v62.1,47.4
  Bottom 0.254: 62.23,47.4 v62.1,47.4
  Bottom 0.305: v14.35,50.94 v26.04,50.94 | v35.31,50.8 47.24,50.8 v47.37,50.93
  Bottom 0.508: R10.2 63.53,47.4 62.23,47.4
M0  (via drill 0.35)
  Top 0.254: R28.1 35.11,10.03 LED6.K 36.32,5.74 v36.45,5.61
  Top 1.016: TB1.B2 TB1.A2
  Bottom 0.254: v36.45,5.61 38.1,3.96 TB1.A2
  Bottom 1.27: TB1.A2 38.1,3.31 39.71,4.93 53.36,4.93 54.61,3.68 MOT.1
M1
  Top 0.254: TB1.B1 28.32,7.24 LED2.K | R29.1 42.86,4.76 TB1.A1
  Top 1.016: TB1.B1 33.02,3.35 34.31,4.65 39.47,4.65 40.64,3.48 TB1.A1
  Bottom 1.27: MOT.2 57.15,4.99 55.4,6.73 34.67,6.73 33.02,5.08 TB1.B1
N$1
  Top 0.254: LED1.A 54.74,30.48 R17.2
N$2
  Top 0.508: F4.2 D10.A
N$3
  Top 0.508: X5.2 D11.A
N$4
  Top 0.305: LED3.A 60.13,13.14 57.15,13.14 56.13,14.16 R3.2
N$5
  Top 0.305: U$6.OUT1+ U$6.OUT2+
  Top 0.508: U$6.OUT1+ 17.83,29.21 F4.1
  Bottom 1.016: 16.51,23.5 C21.+ 13.97,23.5
  Bottom 1.27: U$6.OUT2+ 16.51,29.13 16.51,23.5 16.51,21.59 F3.1
N$6
  Top 0.305: 62.23,8.96 62.2,8.93 | Q3.3 62.2,7.91 62.2,8.93 | LED3.K 61.72,11.05 62.2,10.58 62.2,8.93
  Top 0.813: Q3.3 62.23,7.8 MOT.4
N$7
  Top 0.254: R28.2 32.83,9.91 LED2.A
N$8
  Top 0.508: R14.2 R24.1 58.17,9.84 59.18,8.82 Q3.1
N$9
  Top 0.254: LED8.A 57.4,16.82 R27.2
N$10  (via drill 0.35)
  Top 0.508: R15.2 Q1.1 63,31.62 v65.15,31.62
  Bottom 0.254: 64.77,31.62 v65.15,31.62
  Bottom 0.508: R22.1 62.93,31.62 64.77,31.62
N$11
  Top 0.305: R34.1 34.04,56.01 35.18,57.15 38.48,57.15 39.37,56.26 X6.3
N$12
  Top 0.305: R35.1 33.4,53.21 36.07,55.88 X6.4
N$13
  Top 0.254: LED6.A 40.71,10.03 R29.2
N$14  (via drill 0.35)
  Top 0.254: v55.75,28.19 R16.2 Q2.1
  Bottom 0.508: R23.1 56.7,28.19 v55.75,28.19
N$15
  Top 0.254: R30.2 28.32,14.54 LED4.A
N$16
  Top 0.254: R31.2 21.65,35.31 LED5.A
N$32
  Top 0.254: Q1.3 LED1.K
  Top 0.508: Q1.3 66.67,30.35 69.09,27.94 IO1.4
N$35  (via drill 0.35)
  Top 0.254: v60.83,23.11 60.83,25.58 Q2.3
  Top 0.508: IO1.3 70.88,26.91 62.36,26.91 62.36,25.91 62.1,25.65 Q2.3
  Bottom 0.254: LED8.K 59.05,21.34 v60.83,23.11
OD_IN_L
  Bottom 0.508: IO1.2 70.12,25.13 C5.1 64.06,25.13 R8.2
OD_IN_LIGHT_PB12  (via drill 0.35)
  Top 0.254: 53.17,22.43 D5.C
  Top 0.305: v14.76,46.23 14.21,46.78 5.99,46.78 4.51,48.26 U$1.P$1 | v28.1,40.65 28.27,40.82 28.27,41.98 26.95,43.31 25.02,43.31 23.75,44.58 20.83,44.58 20.83,45.21 20.04,46 v17.14,46 | v29.46,39.24 v44.2,39.24 | v43.69,35.69 43.69,34.1 43.57,33.98 43.57,30.22 v44.7,29.08 | v46.35,28.32 47.27,27.4 47.27,26.93 51.77,22.43 53.17,22.43
  Top 0.508: v62.23,22.86 62.66,22.43 D5.C 66.56,22.43 R9.1
  Bottom 0.305: v14.76,46.23 14.99,46 v17.14,46 | v28.1,40.65 29.46,39.28 v29.46,39.24 | v44.2,39.24 44.2,36.2 v43.69,35.69 | v44.7,29.08 45.47,28.32 v46.35,28.32
  Bottom 0.508: R8.1 63.69,22.86 v62.23,22.86
OD_OUT_BUTTON_PB13  (via drill 0.35)
  Top 0.152: 55.59,24.54 R16.1
  Top 0.254: R16.1 55.53,24.48
  Top 0.305: U$1.P$2 9.64,51.55 v13.72,51.55 | v24.77,51.72 25.43,51.05 25.43,50.11 25.58,49.96 25.58,46.51 29.59,42.5 29.59,41.5 44.35,41.5 44.53,41.69 45.55,41.69 46.34,40.9 46.34,40.82 v46.51,40.65 | v46.54,36.45 47.88,35.11 v47.88,30.01 | v47.88,27.18 50.58,24.48 55.53,24.48
  Bottom 0.305: v13.72,51.55 24.59,51.55 v24.77,51.72 | v46.51,40.65 46.51,36.48 v46.54,36.45 | v47.88,30.01 v47.88,27.18
PB10_OUT_SOLENOID  (via drill 0.35)
  Top 0.305: U$1.P$26 17.21,33.02 19.52,30.71 22.61,30.71 22.84,30.48 22.84,29.89 23.95,28.78 26.29,28.78 27.51,27.56 27.51,23.95 29.2,22.26 v37.5,22.26 | v47.33,21.67 50.42,18.58 50.42,9.27 51.75,7.94 R14.1
  Bottom 0.305: v37.5,22.26 46.74,22.26 v47.33,21.67
RPM_EXTI11  (via drill 0.2, 0.35)
  Top 0.2: 63.46,34.57 R5.1
  Top 0.254: 67.09,34.08 D1.C
  Top 0.305: U$1.P$25 17.14,36.2 23.88,36.2 v25.15,37.47 | v34.92,37.5 36.1,37.5 36.37,37.77 44.8,37.77 45.06,38.03 v48.64,38.03 | v54.36,38.61 60.2,38.61 62.1,36.7 62.1,34.61 | v62.07,34.64 62.1,34.61 | 62.1,34.61 R5.1
  Top 0.508: R5.1 64.03,34.08 67.09,34.08
  Bottom 0.152: 62.1,34.61 v62.07,34.64
  Bottom 0.254: 62.1,34.61 R5.1
  Bottom 0.305: v25.15,37.47 34.89,37.47 v34.92,37.5 | v48.64,38.03 53.78,38.03 v54.36,38.61
RPM_IN
  Bottom 0.2: 63.55,36.56 R2.1
  Bottom 0.508: IO2.2 67.58,36.83 C1.1 63.55,36.56
RX  (via drill 0.35)
  Top 0.305: v24.21,45.58 24.04,45.75 22.26,45.75 19.75,48.26 U$1.P$7 | v35.6,45.68 35.85,45.92 40.18,45.92 40.77,46.51 40.77,51.56 49.63,51.56 49.96,51.89 49.96,52.5 X5.5
  Bottom 0.152: X5.5
  Bottom 0.305: v24.21,45.58 35.5,45.58 v35.6,45.68
SCL  (via drill 0.35)
  Top 0.305: IC1.6 18.86,53.98 R25.2 22.04,54.86 28.77,54.86 R34.2 30.86,55.06 v30.86,54.48 | v31.24,51.44 35.69,51.44 36.83,50.29 U$1.P$14
  Bottom 0.305: v30.86,54.48 30.86,51.82 v31.24,51.44
SDA
  Top 0.305: IC1.5 20.39,52.7 R26.2 22.11,54.43 28.69,54.43 R35.2 31.05,52.07 37.47,52.07 39.37,50.16 U$1.P$15
SPD_IN
  Bottom 0.508: IO2.3 70.48,41.27 69.03,41.27 68.67,41.64 C2.1 64.19,41.64 R1.1
STOP_IN
  Bottom 0.2: 56.5,44.58 C4.1 | 60.53,44.31 R6.1
  Bottom 0.508: C4.1 60.53,44.31 | R6.1 61.45,43.39 67.82,43.39 69.3,41.91 IO2.4
STOP_IN_PA3  (via drill 0.2, 0.35)
  Top 0.152: 56.47,41.91 D3.C
  Top 0.305: U$1.P$33 34.29,38.1 35,38.81 43.77,38.81 43.95,38.63 44.45,38.63 45.05,39.24 v50.8,39.24 | v56.77,40.4 D3.C
  Top 0.508: D3.C 59.83,41.61 R7.2 v60.58,40.96
  Bottom 0.254: R7.2 v60.58,40.96
  Bottom 0.305: v50.8,39.24 55.61,39.24 v56.77,40.4
SW_IN
  Bottom 0.508: R18.1 66.88,12.13 C8.1 67.58,11.7 69.85,13.97 SW.2
SWDCLK
  Top 0.508: X5.4 SWDCLK.1
SWDIO
  Top 0.508: X5.3 SWDIO.1
SWITCH_ADC  (via drill 0.35)
  Top 0.254: 58.42,15.62 58.35,15.62
  Top 0.305: v64.01,15.62 58.42,15.62 54.23,15.62 v46.99,22.86 | U$1.P$27 20.93,31.14 22.95,31.14 23.27,30.83 23.27,30.07 24.13,29.21 26.67,29.21 27.94,27.94 27.94,24.13 29.21,22.86 v36.83,22.86
  Top 0.508: R19.1 v64.01,15.62 66.09,15.62 D7.C
  Bottom 0.305: v36.83,22.86 v46.99,22.86
  Bottom 0.508: R19.1 v64.01,15.62
TB6612FNG_STB  (via drill 0.35)
  Top 0.305: U$1.P$13 34.29,44.07 34.98,43.38 v40.13,43.38 | v40.13,37.17 40.13,34.1 40.25,33.98 40.25,32.06 40.13,31.94 40.13,24.64 40.64,24.13 TB1.STBY
  Bottom 0.305: v40.13,43.38 v40.13,37.17
TIM3_CH2_SPD  (via drill 0.2, 0.35)
  Top 0.254: 63.92,39.16 63.7,39.37
  Top 0.305: U$1.P$12 31.75,43.18 32.99,41.94 44.17,41.94 44.35,42.12 45.73,42.12 45.91,41.94 50.88,41.94 v51.36,42.42 | v53.98,41.02 55.84,39.16 v61.98,39.16
  Top 0.508: R4.1 66.56,38.94 D2.C 63.92,39.16 v61.98,39.16
  Bottom 0.127: 63.81,39.37 R1.2
  Bottom 0.305: v51.36,42.42 53.09,42.42 53.98,41.53 v53.98,41.02
  Bottom 0.508: v61.98,39.16 63.6,39.16 R1.2
TPS_ADC  (via drill 0.2, 0.35)
  Top 0.152: C3.1 59.01,34.61 | 55.47,33.88 55.33,34.03
  Top 0.2: 55.9,34.27 D8.C 55.47,33.88 55.07,34.29
  Top 0.254: 55.42,34.03 55.33,34.03
  Top 0.305: v33.02,38.1 29.46,38.1 28.07,36.7 28.07,32.13 27.18,31.24 23.75,31.24 21.97,33.02 U$1.P$28 | v49.53,38.63 45.06,38.63 44.62,38.2 35.66,38.2 v35.56,38.1 | v53.4,38.63 53.4,35.96 D8.C
  Top 0.508: 55.9,34.27 58.76,34.27 C3.1 v59.05,33.02
  Bottom 0.305: v33.02,38.1 v35.56,38.1 | v49.53,38.63 v53.4,38.63
  Bottom 0.508: v59.05,33.02 R20.2 R21.1
TPS_IN  (via drill 0.2)
  Top 0.508: v60.33,33.4 65.63,33.4 66.25,32.78 70.88,32.78 IO2.1
  Bottom 0.508: R20.1 59.92,35.64 59.96,35.64 60.33,35.28 v60.33,33.4
TX  (via drill 0.35)
  Top 0.305: U$1.P$6 17.99,49.74 21.95,49.74 22.04,49.66 22.99,49.66 23.25,49.39 23.25,47.3 24.13,46.42 v24.13,46.35 | v35.18,46.35 40.01,46.35 40.01,47.05 40.25,47.3 40.25,49.22 40.01,49.47 40.01,51.44 40.64,52.07 49.53,52.07 49.53,54.61 X5.6
  Bottom 0.254: X5.6 50.68,55.76
  Bottom 0.305: v24.13,46.35 v35.18,46.35
VCC  (via drill 0.35)
  Top 0.254: C24.1 21.59,38.99 R31.1 | v24.06,53.21 R26.1
  Top 0.305: 40.13,57.66 40.21,57.58 | IC1.8 18.54,56.52 19.18,57.15 24.13,57.15 | 24.13,57.15 34.57,57.15 35,57.58 40.21,57.58 | 40.21,57.58 X6.2 | 24.13,57.15 v24.13,56.07 24.06,56.01 R25.1 | v51.56,12.06 53.72,12.06 54.34,12.69 54.34,13.02 54.55,13.23 56.2,13.23 57.29,12.13 R19.2
  Top 0.508: 45.72,3.48 TB1.VCC v45.72,10.16 | IC3.4 20.32,40.64 21.59,39.37 21.97,39.37 C24.1 22.55,39.94 C25.2 52,39.94 52.07,39.88 | v11.43,35.56 15.24,35.56 15.47,35.79 IC3.4 | v8.89,35.56 U$1.P$23 | D11.C 60.36,48.26 U$1.P$20 52.07,39.88 | 51.63,12.13 v51.56,12.06 | 52.07,39.88 U$1.P$40 | IC3.4 15.47,50.83 14.35,51.94 14.35,56.13 14.73,56.52 IC1.8
  Bottom 0.305: v24.13,56.07 24.13,53.28 v24.06,53.21
  Bottom 0.508: v11.43,35.56 v8.89,35.56 | v45.72,10.16 47.62,12.06 v51.56,12.06 52.07,12.57 U$1.P$40
  other vias: 17.4,41.91 18.67,41.91 18.67,43.18 17.4,43.18 16.13,43.18 17.4,40.64 18.67,40.64 17.4,39.37 18.67,39.37 18.67,38.1 17.4,38.1 16.13,38.1
  pour Top (no thermals): 19.94,36.83 14.86,36.83 14.86,45.09 19.94,45.09
  pour Bottom (isolate 1.27): 11.05,45.09 11.05,36.83 19.94,36.83 19.94,45.09
VNH2_SP30_INA  (via drill 0.35)
  Top 0.254: 38.1,17.54 TB1.BIN1 38.1,17.41 38.8,16.71 42.48,16.71 43.18,17.41 43.18,17.78 TB1.AIN1
  Top 0.305: U$1.P$16 41.91,44.18 v40.91,43.18 | v40.77,36.7 40.77,24.61 41.07,24.31 41.07,19.89 43.18,17.78
  Bottom 0.305: v40.91,43.18 40.77,43.04 v40.77,36.7
VNH2_SP30_INB  (via drill 0.35)
  Top 0.254: 35.56,18.54 TB1.BIN2 35.56,17.41 36.82,16.15 44.71,16.15 45.72,17.16 TB1.AIN2
  Top 0.305: U$1.P$17 44.45,45.72 v41.91,43.18 | v41.91,36.83 41.91,34.86 42.79,33.98 42.79,21.98 v43.69,21.08
  Bottom 0.305: v41.91,43.18 v41.91,36.83 | v43.69,21.08 45.72,19.05 TB1.AIN2
VNH2_SP30_PWM
  Top 0.152: TB1.PWMB 33.4,18.03
  Top 0.254: TB1.PWMB 33.02,16.78 34.2,15.6 46.95,15.6 48.26,16.91 TB1.PWMA
  Top 0.305: U$1.P$36 41.91,21.59 43.18,20.32 46.99,20.32 48.26,19.05 TB1.PWMA

### Text on the board
Top: CruiseTLCPrado95 / pcb version 1.0 / made by Degtyarev Aleksey / degterev_alex@mail.ru / vk.com\hyper1on / youtube.com/c/HyperionAuto
Bottom: IO | SDA | SCL | VCC | GND | TX | RX | CLK | VCC | GND | GND | IDL | STP | SPD | RPM | TPS | CRUISEBT | ODBT | ODO | ODI | SW | GND